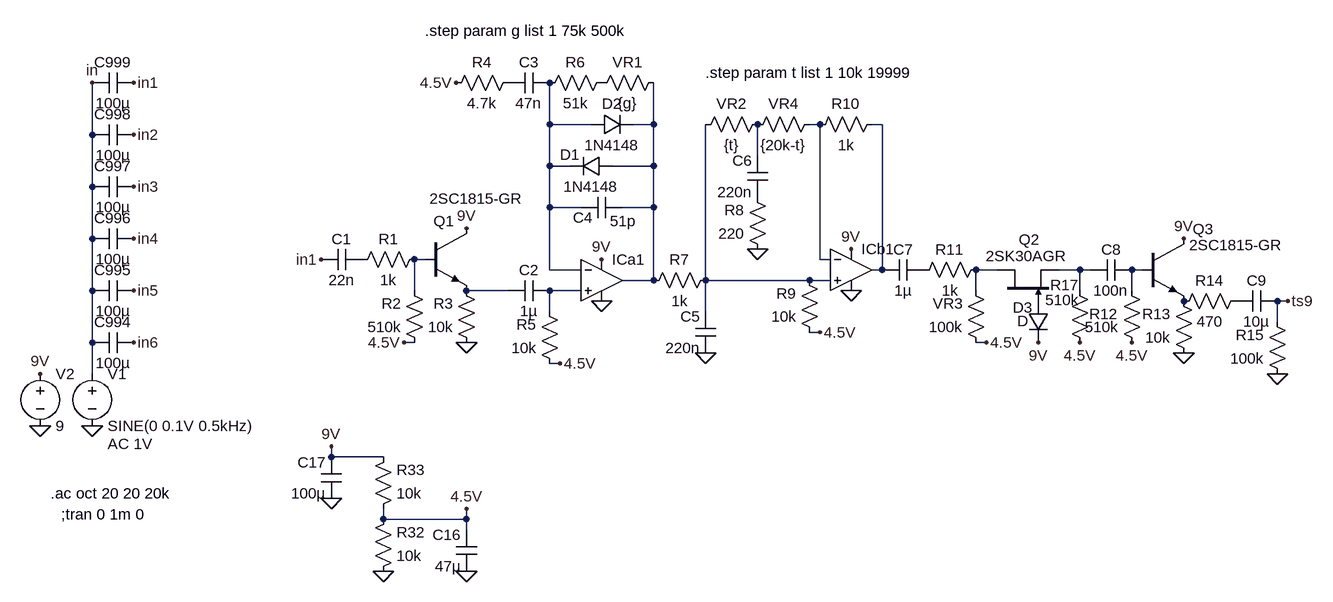
[diagram p0: schematic ts9.asc]
ts9.asc, the LTspice schematic file:
Version 4
SHEET 1 4260 4108
WIRE -2784 1312 -2784 1248
WIRE -2720 1312 -2784 1312
WIRE -2624 1312 -2624 1248
WIRE -2624 1312 -2656 1312
WIRE -2368 1312 -2384 1312
WIRE -2272 1312 -2288 1312
WIRE -3488 1328 -3488 1248
WIRE -2464 1360 -2464 1312
WIRE -2784 1376 -2784 1312
WIRE -2752 1376 -2784 1376
WIRE -2624 1376 -2624 1312
WIRE -2624 1376 -2688 1376
WIRE -3488 1408 -3488 1328
WIRE -2784 1440 -2784 1376
WIRE -2736 1440 -2784 1440
WIRE -2624 1440 -2624 1376
WIRE -2624 1440 -2672 1440
WIRE -3488 1488 -3488 1408
WIRE -2976 1520 -2992 1520
WIRE -2368 1520 -2368 1312
WIRE -2352 1520 -2368 1520
WIRE -2784 1536 -2784 1440
WIRE -2736 1536 -2784 1536
WIRE -2272 1536 -2272 1312
WIRE -2272 1536 -2288 1536
WIRE -2096 1536 -2128 1536
WIRE -1968 1536 -2000 1536
WIRE -1952 1536 -1968 1536
WIRE -1872 1536 -1888 1536
WIRE -2624 1552 -2624 1440
WIRE -2624 1552 -2672 1552
WIRE -2544 1552 -2544 1312
WIRE -2384 1552 -2544 1552
WIRE -2352 1552 -2384 1552
WIRE -3488 1568 -3488 1488
WIRE -2992 1568 -2992 1520
WIRE -2848 1568 -2912 1568
WIRE -2736 1568 -2784 1568
WIRE -2128 1568 -2128 1536
WIRE -1968 1568 -1968 1536
WIRE -1888 1568 -1888 1536
WIRE -1648 1584 -1664 1584
WIRE -2784 1600 -2784 1568
WIRE -2544 1600 -2544 1552
WIRE -1664 1616 -1664 1584
WIRE -2368 1632 -2384 1632
WIRE -3488 1648 -3488 1568
WIRE -2992 1648 -3008 1648
WIRE -2112 1648 -2128 1648
WIRE -2768 1680 -2784 1680
WIRE -3488 1696 -3488 1648
WIRE -3120 1824 -3120 1808
WIRE -3040 1824 -3120 1824
WIRE -3040 1920 -3040 1904
WIRE -2912 1920 -2912 1904
WIRE -2912 1920 -3040 1920
WIRE -2912 1936 -2912 1920
FLAG -3120 1888 0
FLAG -3040 2000 0
FLAG -2912 2000 0
FLAG -2912 1904 4.5V
FLAG -3120 1808 9V
FLAG -3488 1776 0
FLAG -3488 1248 in
FLAG -3568 1776 0
FLAG -3568 1696 9V
FLAG -3424 1248 in1
FLAG -3424 1328 in2
FLAG -3424 1408 in3
FLAG -3424 1488 in4
FLAG -3424 1568 in5
FLAG -3424 1648 in6
FLAG -2704 1520 9V
FLAG -2912 1648 0
FLAG -2704 1584 0
FLAG -3008 1648 4.5V
FLAG -2768 1680 4.5V
FLAG -2928 1248 4.5V
FLAG -2912 1472 9V
FLAG -3136 1520 in1
FLAG -2544 1664 0
FLAG -2320 1504 9V
FLAG -2320 1568 0
FLAG -2464 1504 0
FLAG -2368 1632 4.5V
FLAG -1888 1648 4.5V
FLAG -1808 1664 0
FLAG -1664 1696 0
FLAG -1808 1488 9V
FLAG -2112 1648 4.5V
FLAG -1648 1584 ts9
FLAG -2032 1648 9V
FLAG -1968 1648 4.5V
SYMBOL cap -3104 1888 R180
WINDOW 0 24 56 Left 2
WINDOW 3 24 8 Left 2
SYMATTR InstName C17
SYMATTR Value 100µ
SYMBOL res -3056 1920 M180
WINDOW 0 36 76 Left 2
WINDOW 3 36 40 Left 2
SYMATTR InstName R33
SYMATTR Value 10k
SYMBOL res -3056 2016 M180
WINDOW 0 36 76 Left 2
WINDOW 3 36 40 Left 2
SYMATTR InstName R32
SYMATTR Value 10k
SYMBOL cap -2896 2000 R180
WINDOW 0 24 56 Left 2
WINDOW 3 24 8 Left 2
SYMATTR InstName C16
SYMATTR Value 47µ
SYMBOL voltage -3488 1680 R0
WINDOW 123 24 124 Left 2
WINDOW 39 0 0 Left 2
SYMATTR Value2 AC 1V
SYMATTR InstName V1
SYMATTR Value SINE(0 0.1V 0.5kHz)
SYMBOL voltage -3568 1680 R0
WINDOW 123 0 0 Left 0
WINDOW 39 0 0 Left 0
SYMATTR InstName V2
SYMATTR Value 9
SYMBOL cap -3424 1312 R90
WINDOW 0 0 32 VBottom 2
WINDOW 3 32 32 VTop 2
SYMATTR InstName C998
SYMATTR Value 100µ
SYMBOL cap -3424 1392 R90
WINDOW 0 0 32 VBottom 2
WINDOW 3 32 32 VTop 2
SYMATTR InstName C997
SYMATTR Value 100µ
SYMBOL cap -3424 1472 R90
WINDOW 0 0 32 VBottom 2
WINDOW 3 32 32 VTop 2
SYMATTR InstName C996
SYMATTR Value 100µ
SYMBOL cap -3424 1232 R90
WINDOW 0 0 32 VBottom 2
WINDOW 3 32 32 VTop 2
SYMATTR InstName C999
SYMATTR Value 100µ
SYMBOL cap -3424 1552 R90
WINDOW 0 0 32 VBottom 2
WINDOW 3 32 32 VTop 2
SYMATTR InstName C995
SYMATTR Value 100µ
SYMBOL cap -3424 1632 R90
WINDOW 0 0 32 VBottom 2
WINDOW 3 32 32 VTop 2
SYMATTR InstName C994
SYMATTR Value 100µ
SYMBOL npn -2976 1472 R0
WINDOW 0 13 -11 Left 2
WINDOW 3 7 -46 Left 2
SYMATTR InstName Q1
SYMATTR Value 2SC1815-GR
SYMBOL cap -3072 1504 R90
WINDOW 0 0 32 VBottom 2
WINDOW 3 32 32 VTop 2
SYMATTR InstName C1
SYMATTR Value 22n
SYMBOL res -2976 1504 R90
WINDOW 0 0 56 VBottom 2
WINDOW 3 32 56 VTop 2
SYMATTR InstName R1
SYMATTR Value 1k
SYMBOL res -2976 1664 R180
WINDOW 0 36 76 Left 2
WINDOW 3 36 40 Left 2
SYMATTR InstName R2
SYMATTR Value 510k
SYMBOL res -2896 1664 R180
WINDOW 0 36 76 Left 2
WINDOW 3 36 40 Left 2
SYMATTR InstName R3
SYMATTR Value 10k
SYMBOL cap -2784 1552 R90
WINDOW 0 0 32 VBottom 2
WINDOW 3 32 32 VTop 2
SYMATTR InstName C2
SYMATTR Value 1µ
SYMBOL res -2944 1264 R270
WINDOW 0 32 56 VTop 2
WINDOW 3 0 56 VBottom 2
SYMATTR InstName R4
SYMATTR Value 4.7k
SYMBOL res -2768 1696 R180
WINDOW 0 36 76 Left 2
WINDOW 3 36 40 Left 2
SYMATTR InstName R5
SYMATTR Value 10k
SYMBOL cap -2784 1232 R90
WINDOW 0 0 32 VBottom 2
WINDOW 3 32 32 VTop 2
SYMATTR InstName C3
SYMATTR Value 47n
SYMBOL cap -2672 1424 R90
WINDOW 0 47 61 VBottom 2
WINDOW 3 21 -1 VTop 2
SYMATTR InstName C4
SYMATTR Value 51p
SYMBOL res -2688 1232 R90
WINDOW 0 0 56 VBottom 2
WINDOW 3 32 56 VTop 2
SYMATTR InstName R6
SYMATTR Value 51k
SYMBOL diode -2688 1360 R90
WINDOW 0 14 65 VBottom 2
WINDOW 3 32 32 VTop 2
SYMATTR InstName D1
SYMATTR Value 1N4148
SYMBOL diode -2720 1328 R270
WINDOW 0 32 32 VTop 2
WINDOW 3 0 32 VBottom 2
SYMATTR InstName D2
SYMATTR Value 1N4148
SYMBOL res -2608 1232 R90
WINDOW 0 0 56 VBottom 2
WINDOW 3 32 56 VTop 2
SYMATTR InstName VR1
SYMATTR Value {g}
SYMBOL res -2528 1536 R90
WINDOW 0 0 56 VBottom 2
WINDOW 3 32 56 VTop 2
SYMATTR InstName R7
SYMATTR Value 1k
SYMBOL cap -2528 1664 R180
WINDOW 0 24 56 Left 2
WINDOW 3 24 8 Left 2
SYMATTR InstName C5
SYMATTR Value 220n
SYMBOL res -2448 1520 R180
WINDOW 0 36 76 Left 2
WINDOW 3 36 40 Left 2
SYMATTR InstName R8
SYMATTR Value 220
SYMBOL cap -2448 1424 R180
WINDOW 0 24 56 Left 2
WINDOW 3 24 8 Left 2
SYMATTR InstName C6
SYMATTR Value 220n
SYMBOL res -2448 1296 R90
WINDOW 0 0 56 VBottom 2
WINDOW 3 32 56 VTop 2
SYMATTR InstName VR2
SYMATTR Value {t}
SYMBOL res -2368 1296 R90
WINDOW 0 0 56 VBottom 2
WINDOW 3 32 56 VTop 2
SYMATTR InstName VR4
SYMATTR Value {20k-t}
SYMBOL res -2368 1648 R180
WINDOW 0 36 76 Left 2
WINDOW 3 36 40 Left 2
SYMATTR InstName R9
SYMATTR Value 10k
SYMBOL res -2272 1296 R90
WINDOW 0 0 56 VBottom 2
WINDOW 3 32 56 VTop 2
SYMATTR InstName R10
SYMATTR Value 1k
SYMBOL cap -2208 1520 R90
WINDOW 0 0 32 VBottom 2
WINDOW 3 32 32 VTop 2
SYMATTR InstName C7
SYMATTR Value 1µ
SYMBOL res -2112 1520 R90
WINDOW 0 0 56 VBottom 2
WINDOW 3 32 56 VTop 2
SYMATTR InstName R11
SYMATTR Value 1k
SYMBOL res -2112 1664 R180
WINDOW 0 36 76 Left 2
WINDOW 3 36 40 Left 2
SYMATTR InstName VR3
SYMATTR Value 100k
SYMBOL njf -2096 1584 R270
WINDOW 0 95 34 VRight 2
WINDOW 3 69 -17 VRight 2
SYMATTR InstName Q2
SYMATTR Value 2SK30AGR
SYMBOL cap -1888 1520 R90
WINDOW 0 0 32 VBottom 2
WINDOW 3 32 32 VTop 2
SYMATTR InstName C8
SYMATTR Value 100n
SYMBOL res -1872 1664 R180
WINDOW 0 37 60 Left 2
WINDOW 3 36 40 Left 2
SYMATTR InstName R12
SYMATTR Value 510k
SYMBOL res -1792 1680 R180
WINDOW 0 36 76 Left 2
WINDOW 3 36 40 Left 2
SYMATTR InstName R13
SYMATTR Value 10k
SYMBOL npn -1872 1488 R0
WINDOW 0 78 -15 Left 2
WINDOW 3 72 10 Left 2
SYMATTR InstName Q3
SYMATTR Value 2SC1815-GR
SYMBOL res -1712 1568 R90
WINDOW 0 0 56 VBottom 2
WINDOW 3 32 56 VTop 2
SYMATTR InstName R14
SYMATTR Value 470
SYMBOL cap -1664 1568 R90
WINDOW 0 0 32 VBottom 2
WINDOW 3 32 32 VTop 2
SYMATTR InstName C9
SYMATTR Value 10µ
SYMBOL res -1648 1712 R180
WINDOW 0 36 76 Left 2
WINDOW 3 36 40 Left 2
SYMATTR InstName R15
SYMATTR Value 100k
SYMBOL diode -2048 1584 R0
WINDOW 0 -23 10 Left 2
WINDOW 3 -16 31 Left 2
SYMATTR InstName D3
SYMBOL res -1952 1664 R180
WINDOW 0 17 105 Left 2
WINDOW 3 17 82 Left 2
SYMATTR InstName R17
SYMATTR Value 510k
SYMBOL OpAmps\\UniversalOpAmp2 -2704 1552 R0
SYMATTR InstName ICa1
SYMBOL OpAmps\\UniversalOpAmp2 -2320 1536 R0
SYMATTR InstName ICb1
TEXT -3552 1880 Left 2 !.ac oct 20 20 20k
TEXT -3536 1912 Left 2 !;tran 0 1m 0
TEXT -2976 1168 Left 2 !.step param g list 1 75k 500k
TEXT -2544 1232 Left 2 !.step param t list 1 10k 19999

The netlist it stands for:
* ts9.asc
C17 0 9V 100µ
R33 4.5V 9V 10k
R32 0 4.5V 10k
C16 0 4.5V 47µ
V1 in 0 SINE(0 0.1V 0.5kHz) AC 1V
V2 9V 0 9
C998 in2 in 100µ
C997 in3 in 100µ
C996 in4 in 100µ
C999 in1 in 100µ
C995 in5 in 100µ
C994 in6 in 100µ
Q1 9V N006 N011 0 2SC1815-GR
C1 P001 in1 22n
R1 N006 P001 1k
R2 4.5V N006 510k
R3 0 N011 10k
C2 N012 N011 1µ
R4 4.5V P002 4.7k
R5 4.5V N012 10k
C3 N001 P002 47n
C4 N002 N001 51p
R6 P003 N001 51k
D1 N002 N001 1N4148
D2 N001 N002 1N4148
R§VR1 N002 P003 {g}
R7 N010 N002 1k
C5 0 N010 220n
R8 0 P004 220
C6 P004 N005 220n
R§VR2 N005 N010 {t}
R§VR4 N003 N005 {20k-t}
R9 4.5V N010 10k
R10 N004 N003 1k
C7 P005 N004 1µ
R11 N007 P005 1k
R§VR3 4.5V N007 100k
J§Q2 N007 P006 N008 2SK30AGR
C8 N009 N008 100n
R12 4.5V N009 510k
R13 0 P007 10k
Q3 9V N009 P007 0 2SC1815-GR
R14 P008 P007 470
C9 ts9 P008 10µ
R15 0 ts9 100k
D3 P006 9V D
R17 4.5V N008 510k
XICa1 N012 N001 9V 0 N002 level2 Avol=1Meg GBW=10Meg Slew=10Meg Ilimit=25m Rail=0 Vos=0 En=0 Enk=0 In=0 Ink=0 Rin=500Meg  ; pins In+ In- V+ V- OUT
XICb1 N010 N003 9V 0 N004 level2 Avol=1Meg GBW=10Meg Slew=10Meg Ilimit=25m Rail=0 Vos=0 En=0 Enk=0 In=0 Ink=0 Rin=500Meg  ; pins In+ In- V+ V- OUT
.model D D
.lib standard.dio
.model NPN NPN
.model PNP PNP
.lib standard.bjt
.model NJF NJF
.model PJF PJF
.lib standard.jft
.ac oct 20 20 20k
;tran 0 1m 0
.step param g list 1 75k 500k
.step param t list 1 10k 19999
.lib UniversalOpAmp2.lib
.backanno
.end